# Altium schematic sheet gameConsole.SchDoc: Doodle Snake Game Console
size A4; Date: 2019/10/06; DrawnBy: Xiabingquan; Engineer: Xia Bingquan; DocumentName: sheet1; ProjectName: Doodle Snake Game Console
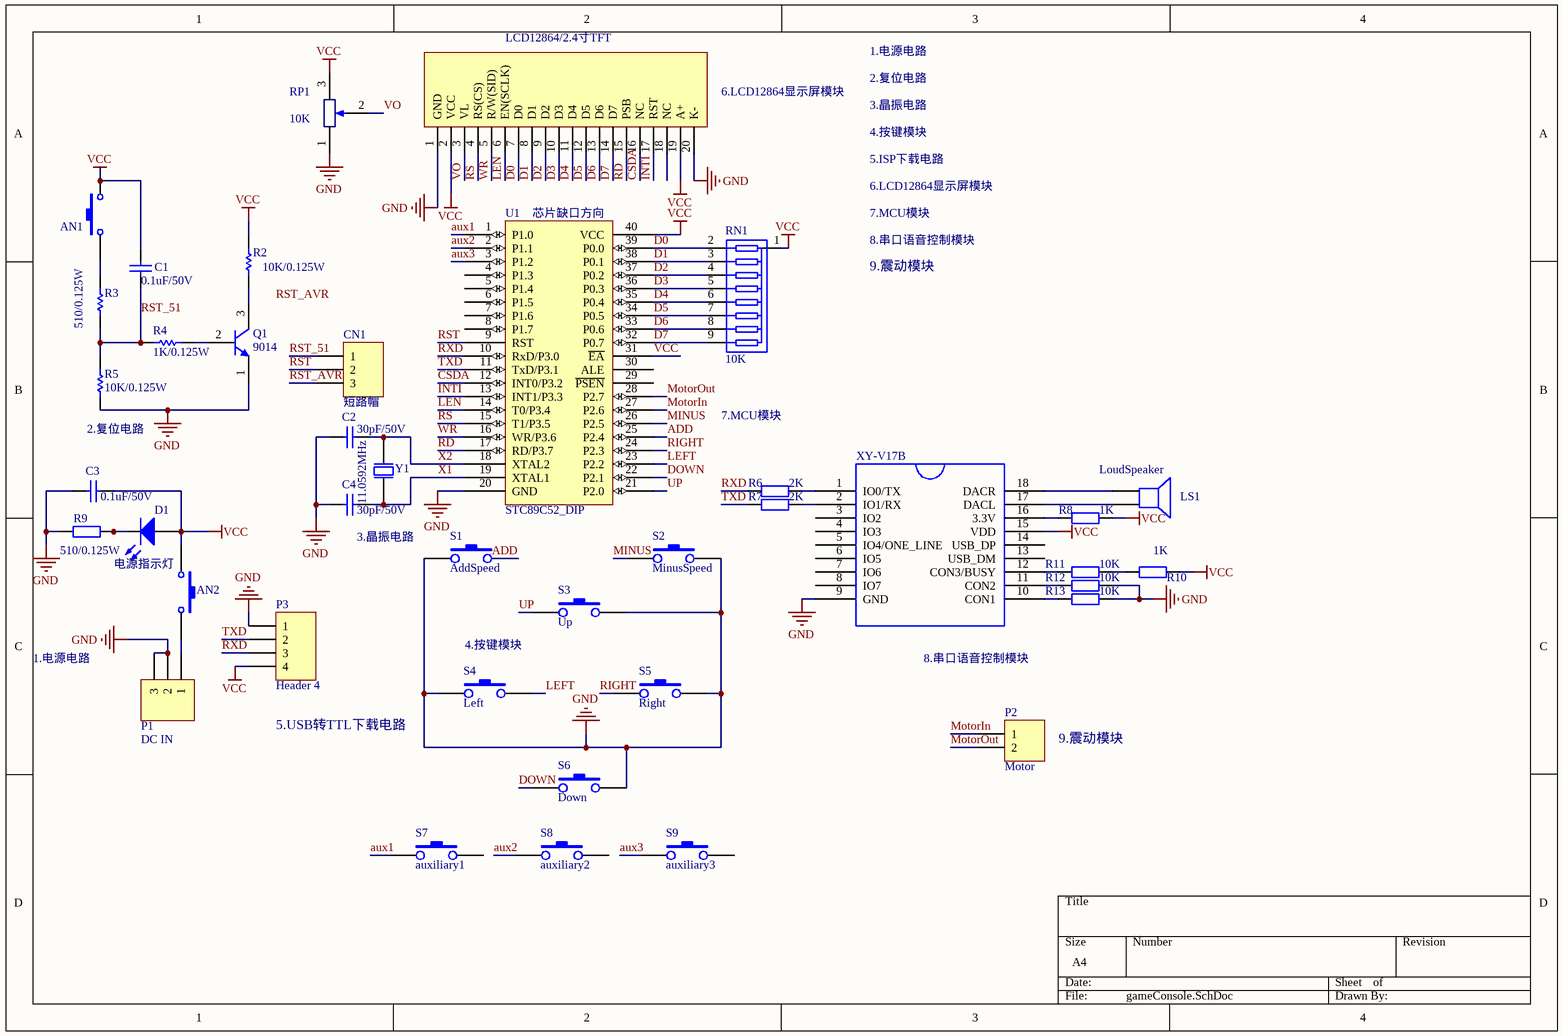
[diagram p0: gameConsole.SchDoc]

## Parts
AN1  Button  [BUTTON_6*6]  (value not drawn)
AN2  微动开关  [sw_8.5mm]  (value not drawn)
C1  0.1uF/50V  [Cap]
C2  value 30pF/50V  [Cap]  (hidden comment: Cap)
C3  0.1uF/50V  [Cap]
C4  30pF/50V  [Cap]
CN1  短路帽  [SIP-3]
D1  电源指示灯  [LED-1]
LCD1  LCD12864/2.4寸TFT  [HDR1X20]
LS1  LoudSpeaker  [扬声器]
P1  DC IN  [DC_IN]
P2  Motor  [震动马达]
P3  Header 4  [USB转TTL]
Q1  9014  [TO-92-3L]
R2  value 10K/0.125W  [AXIAL-0.4]  (hidden comment: Res1)
R3  510/0.125W  [AXIAL-0.4]
R4  1K/0.125W  [AXIAL-0.4]
R5  10K/0.125W  [AXIAL-0.4]
R6  2K  [AXIAL-0.4]
R7  2K  [AXIAL-0.4]
R8  value 1K  [AXIAL-0.4]  (hidden comment: Res2)
R9  510/0.125W  [AXIAL-0.4]
R10  1K  [AXIAL-0.4]
R11  10K  [AXIAL-0.4]
R12  10K  [AXIAL-0.4]
R13  10K  [AXIAL-0.4]
RN1  value 10K  [RES-PACK-DIP9]  (hidden comment: Res Pack Single)
RP1  10K  [RP-3362]
S1  AddSpeed  [BUTTON_6*6]
S2  MinusSpeed  [BUTTON_6*6]
S3  Up  [BUTTON_6*6]
S4  Left  [BUTTON_6*6]
S5  Right  [BUTTON_6*6]
S6  Down  [BUTTON_6*6]
S7  auxiliary1  [BUTTON_6*6]
S8  auxiliary2  [BUTTON_6*6]
S9  auxiliary3  [BUTTON_6*6]
U1  STC89C52_DIP  [DIP-40]
XY-V17B  XY-V17B  [SV1700A]  (value not drawn)
Y1  Frequency: 11.0592MHz  [XTAL-49/U_N]  (hidden comment: XTAL)

## Nets
GND: C2.2 C3.1 C4.2 LCD1.1(GND) LCD1.20(K-) P1.2 P1.3 P3.1 Q1.1(E) R5.1 R9.1 R12.2 R13.2 RP1.1 S1.1 S2.2 S3.2 S4.1 S5.2 S6.2 U1.20(GND) XY-V17B.9(GND)
VCC: AN1.1 AN2.2 C1.2 C3.2 D1.1(A) LCD1.2(VCC) LCD1.19(A+) P3.4 R2.1 R8.2 R10.2 RN1.1 RP1.3 U1.31(~{EA}) U1.40(VCC) XY-V17B.15(VDD)
ADD: S1.2 U1.25(P2.4)
aux1: S7.1 U1.1(P1.0)
aux2: S8.1 U1.2(P1.1)
aux3: S9.1 U1.3(P1.2)
CSDA: LCD1.16(NC) U1.12(INT0/P3.2)
D0: LCD1.7(D0) RN1.2 U1.39(P0.0)
D1: LCD1.8(D1) RN1.3 U1.38(P0.1)
D2: LCD1.9(D2) RN1.4 U1.37(P0.2)
D3: LCD1.10(D3) RN1.5 U1.36(P0.3)
D4: LCD1.11(D4) RN1.6 U1.35(P0.4)
D5: LCD1.12(D5) RN1.7 U1.34(P0.5)
D6: LCD1.13(D6) RN1.8 U1.33(P0.6)
D7: LCD1.14(D7) RN1.9 U1.32(P0.7)
DOWN: S6.1 U1.22(P2.1)
INTI: LCD1.17(RST) U1.13(INT1/P3.3)
LEFT: S4.2 U1.23(P2.2)
LEN: LCD1.6(EN(SCLK)) U1.14(T0/P3.4)
MINUS: S2.1 U1.26(P2.5)
MotorIn: P2.1 U1.27(P2.6)
MotorOut: P2.2 U1.28(P2.7)
RD: LCD1.15(PSB) U1.17(RD/P3.7)
RIGHT: S5.1 U1.24(P2.3)
RS: LCD1.4(RS(CS)) U1.15(T1/P3.5)
RST: CN1.2 U1.9(RST)
RST_51: C1.1 CN1.1 R3.1 R4.2 R5.2
RST_AVR: CN1.3
RXD: P3.3 R6.1 U1.10(RxD/P3.0)
TXD: P3.2 R7.1 U1.11(TxD/P3.1)
UP: S3.1 U1.21(P2.0)
VO: LCD1.3(VL) RP1.2
WR: LCD1.5(R/W(SID)) U1.16(WR/P3.6)
X1: C4.1 U1.19(XTAL1) Y1.1(OSC1)
X2: C2.1 U1.18(XTAL2) Y1.2(OSC2)
NetAN1_2: AN1.2 R3.2
NetAN2_1: AN2.1 P1.1
NetD1_2: D1.2(K) R9.2
NetLS1_1: LS1.1 XY-V17B.18(DACR)
NetLS1_2: LS1.2 XY-V17B.17(DACL)
NetQ1_2: Q1.2(B) R4.1
NetQ1_3: Q1.3(C) R2.2
NetR6_2: R6.2 XY-V17B.1(IO0/TX)
NetR7_2: R7.2 XY-V17B.2(IO1/RX)
NetR8_1: R8.1 XY-V17B.16(3.3V)
NetR10_1: R10.1 R11.2
NetR11_1: R11.1 XY-V17B.12(CON3/BUSY)
NetR12_1: R12.1 XY-V17B.11(CON2)
NetR13_1: R13.1 XY-V17B.10(CON1)

Not connected (* = marked no-connect by the designer): LCD1 18(NC); S7 2; S8 2; S9 2; U1 4(P1.3) 5(P1.4) 6(P1.5) 7(P1.6) 8(P1.7) 29(~{PSEN}) 30(ALE); XY-V17B 3(IO2) 4(IO3) 5(IO4/ONE_LINE) 6(IO5) 7(IO6) 8(IO7) 13(USB_DM) 14(USB_DP)

## Notes on the sheet
- (near LCD1) 6.LCD12864显示屏模块
- 1.电源电路
- 2.复位电路
- 3.晶振电路
- 4.按键模块
- 5.ISP下载电路
- (near U1) 芯片缺口方向
- 6.LCD12864显示屏模块
- 7.MCU模块
- 8.串口语音控制模块
- 9.震动模块
- (near R5) 2.复位电路
- (near C4) 3.晶振电路
- (near P3) 5.USB转TTL下载电路
- Labels drawn without touching a wire or pin: RST_AVR

## Library data of the parts
AN2 = Button: Published: 24-Mar-1999; LatestRevisionDate: 17-Jul-2002; LatestRevisionNote: Re-released for DXP Platform.; PackageReference: SPST-2; Publisher: Altium Limited
C1-C4 = Cap: Capacitor; Published: 8-Jun-2000; LatestRevisionDate: 17-Jul-2002; LatestRevisionNote: Re-released for DXP Platform.; PackageReference: RAD-0.3; Publisher: Altium Limited; PackageDescription: Radial Cap, Thru-Hole; 2 Leads; 0.3 in Pin Spacing
CN1 P1 = Header 3: Header, 3-Pin; LatestRevisionDate: 17-Jul-2002; LatestRevisionNote: Re-released for DXP Platform.; Publisher: Altium Limited
D1 = LED1: Typical RED GaAs LED; Published: 8-Jun-2000; LatestRevisionDate: 08-Jul-2005; LatestRevisionNote: Mech Layer 1 removed.; PackageReference: LED-1; Publisher: Altium Limited; PackageDescription: LED; 2 Leads
LCD1 = LCD12864_1: LCD12864 带字库; HelpURL: https://item.taobao.com/item.htm?spm=a230r.1.14.45.5cbea0a41M151O&id=38971494431&ns=1&abbucket=20#detail
LS1 = Speaker: Published: 24-Mar-1999; LatestRevisionDate: 17-Jul-2002; LatestRevisionNote: Re-released for DXP Platform.; PackageReference: PIN2; Publisher: Altium Limited
P2 = Header 2: Header, 2-Pin; LatestRevisionDate: 17-Jul-2002; LatestRevisionNote: Re-released for DXP Platform.; Publisher: Altium Limited
P3 = Header 4: Header, 4-Pin; LatestRevisionDate: 17-Jul-2002; LatestRevisionNote: Re-released for DXP Platform.; Publisher: Altium Limited
Q1 = 9014_TO-92: NPN型小功率三极管; HelpURL: https://baike.baidu.com/item/9013%E4%B8%89%E6%9E%81%E7%AE%A1/10925006?fr=aladdin
R2-R5 = Res1: Resistor; Published: 8-Jun-2000; LatestRevisionDate: 17-Jul-2002; LatestRevisionNote: Re-released for DXP Platform.; PackageReference: AXIAL-0.3; Publisher: Altium Limited; PackageDescription: Axial Device, Thru-Hole; 2 Leads; 0.3 in Pin Spacing
R6-R13 = Res2: Resistor; Published: 8-Jun-2000; LatestRevisionDate: 17-Jul-2002; LatestRevisionNote: Re-released for DXP Platform.; PackageReference: AXIAL-0.4; Publisher: Altium Limited; PackageDescription: Axial Device, Thru-Hole; 2 Leads; 0.4 in Pin Spacing
RN1 = Res Pack Single: 10K排阻
RP1 = RP_WH148_Signal: WH148单联电位器 3脚 柄长15mm; 购买链接: https://detail.tmall.com/item.htm?spm=a230r.1.14.6.56067276m9JhcC&id=13300625190&cm_id=140105335569ed55e27b&abbucket=13
S1-S9 = 微动开关
XY-V17B = MODULE
Y1 = XTAL: Crystal Oscillator; Published: 8-Jun-2000; Revision: July-2002: Re-released for DXP Platform.; Publisher: Altium Limited
AN1 = Button: Published: 24-Mar-1999; LatestRevisionDate: 17-Jul-2002; LatestRevisionNote: Re-released for DXP Platform.; PackageReference: SPST-2; Publisher: Altium Limited